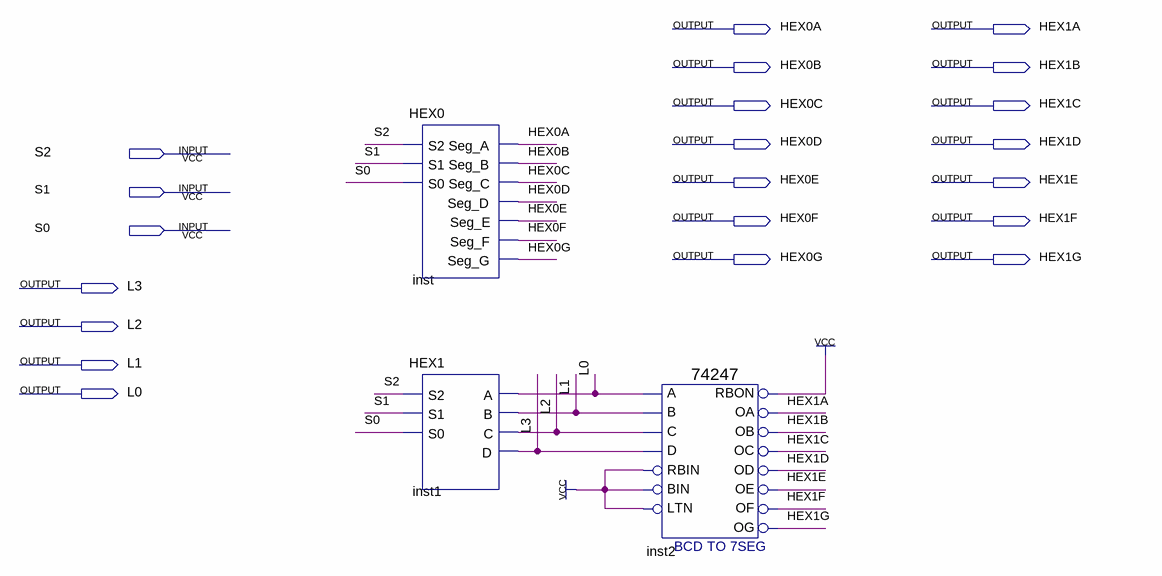
[diagram p0: schematic sheet]
// Quartus schematic projeto_1.bdf as structural Verilog: 3 symbols, 21 pins
module projeto_1 (
  input  S2,
  input  S1,
  input  S0,
  output HEX0A,
  output HEX1A,
  output HEX0B,
  output HEX1B,
  output HEX0C,
  output HEX1C,
  output HEX0D,
  output HEX1D,
  output HEX0E,
  output HEX1E,
  output HEX0F,
  output HEX1F,
  output HEX0G,
  output HEX1G,
  output L3,
  output L2,
  output L1,
  output L0
);

  wire inst2_rbon;

  HEX0 inst (
    .S2(S2), .S1(S1), .S0(S0), .Seg_A(HEX0A), .Seg_B(HEX0B), .Seg_C(HEX0C), .Seg_D(HEX0D), .Seg_E(HEX0E),
    .Seg_F(HEX0F), .Seg_G(HEX0G));
  HEX1 inst1 (.S2(S2), .S1(S1), .S0(S0), .A(L0), .B(L1), .C(L2), .D(L3));
  \74247  inst2 (
    .LTN(1'b1), .BIN(1'b1), .A(L0), .B(L1), .RBIN(1'b1), .C(L2), .D(L3), .OF(HEX1F), .OC(HEX1C), .OD(HEX1D),
    .OE(HEX1E), .RBON(inst2_rbon), .OA(HEX1A), .OB(HEX1B), .OG(HEX1G));
  // also tied to VCC on the sheet: inst2_rbon
endmodule
